# Altium schematic sheet BiSheB.SchDoc
size A4; SheetNumber: 2; SheetTotal: 2
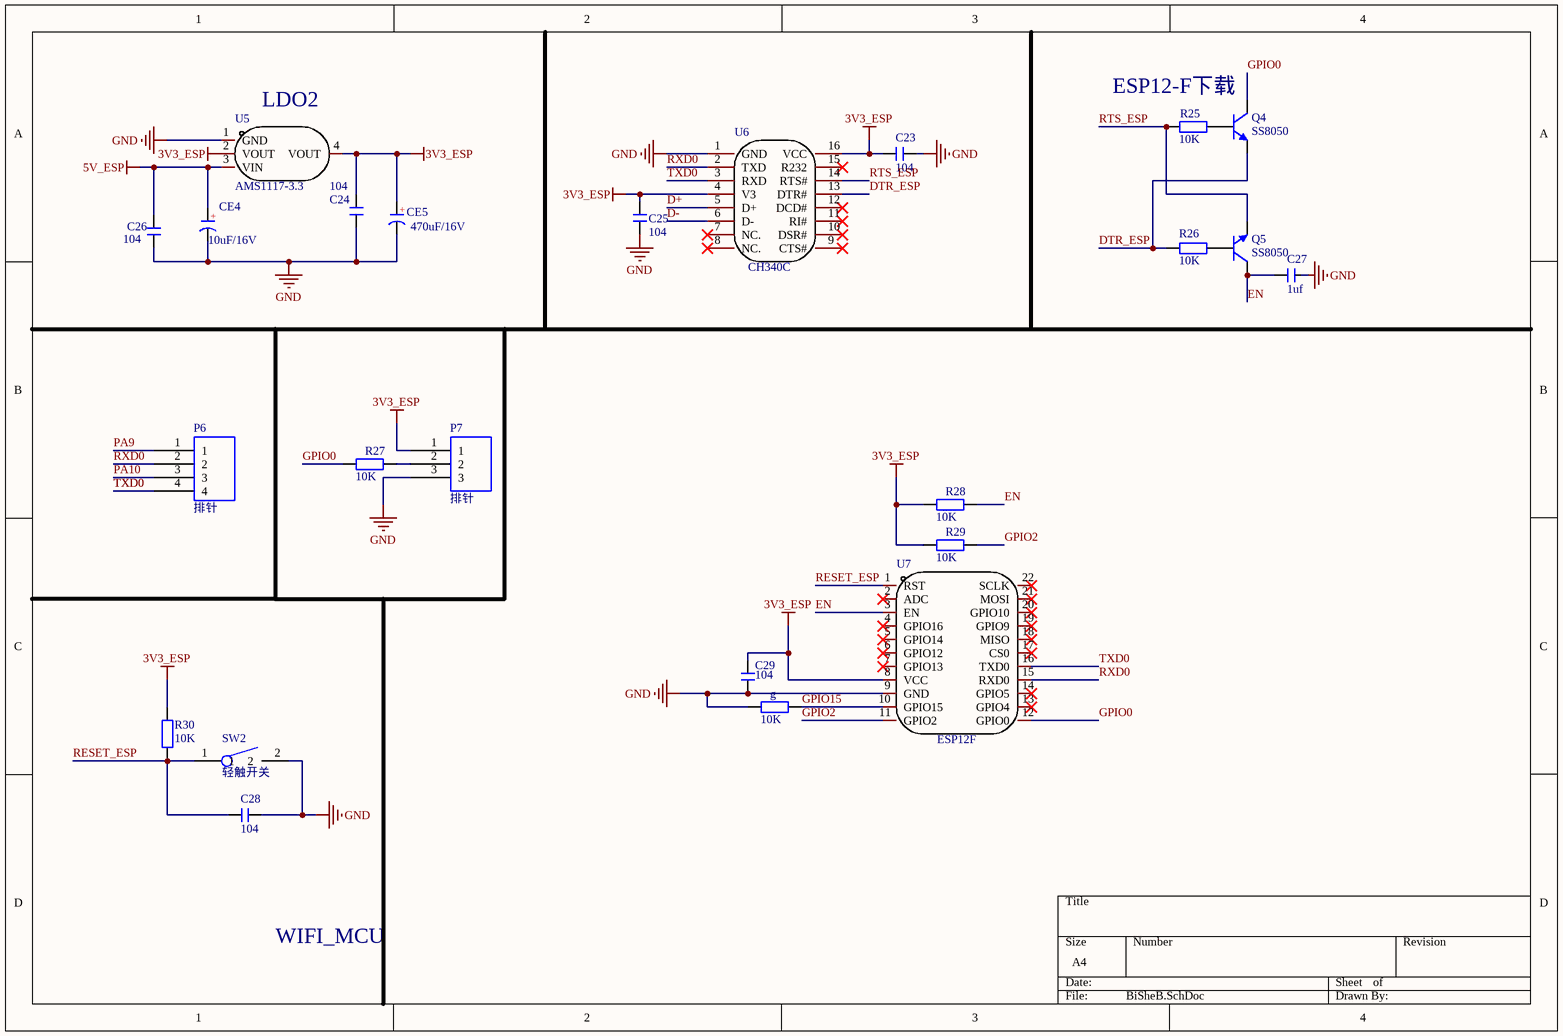
[diagram p0: BiSheB.SchDoc]

## Parts
C23  104  [C 0805_L]
C24  104  [C 0805_L]
C25  104  [C 0805_L]
C26  104  [C 0805_L]
C27  1uf  [C 0805_L]
C28  104  [C 0805_L]
C29  104  [C 0805_L]
CE4  10uF/16V  [CAP 1.5*4*8]
CE5  470uF/16V  [CAP 3.5*8*11.5]
g  10K  [R 0805_L]
P6  排针  [4PIN]
P7  排针  [3Pin]
Q4  SS8050  [SOT23-3N]
Q5  SS8050  [SOT23-3N]
R25  10K  [R 0805_L]
R26  10K  [R 0805_L]
R27  10K  [R 0805_L]
R28  10K  [R 0805_L]
R29  10K  [R 0805_L]
R30  10K  [R 0805_L]
SW2  轻触开关  [SW1P]
U5  AMS1117-3.3  [SOT-223-3_L6.5-W3.4-P2.30-LS7.0-BR]
U6  CH340C  [SOP-16_L10.0-W3.9-P1.27-LS6.0-BL]
U7  ESP12F  [WIFIM-SMD_ESP-12F-ESP8266MOD]

## Nets
3V3_ESP: C23.1 C24.2 C25.2 C29.1 CE5.1(A) P7.1 R28.1 R29.1 R30.1 U5.2(VOUT) U5.4(VOUT) U6.4(V3) U6.16(VCC) U7.8(VCC)
5V_ESP: C26.1 CE4.1(A) U5.3(VIN)
GND: C23.2 C24.1 C25.1 C26.2 C27.2 C28.2 C29.2 CE4.2(K) CE5.2(K) g.1 P7.3 SW2.2 U5.1(GND) U6.1(GND) U7.9(GND)
D+: U6.5(D+)
D-: U6.6(D-)
DTR_ESP: Q4.2(E) R26.2 U6.13(DTR#)
EN: C27.1 Q5.3(C) R28.2 U7.3(EN)
GPIO0: Q4.3(C) R27.1 U7.12(GPIO0)
GPIO2: R29.2 U7.11(GPIO2)
GPIO15: g.2 U7.10(GPIO15)
PA9: P6.1
PA10: P6.3
RESET_ESP: C28.1 R30.2 SW2.1 U7.1(RST)
RTS_ESP: Q5.2(E) R25.2 U6.14(RTS#)
RXD0: P6.2 U6.2(TXD) U7.15(RXD0)
TXD0: P6.4 U6.3(RXD) U7.16(TXD0)
NetP7_2: P7.2 R27.2
NetQ4_1: Q4.1(B) R25.1
NetQ5_1: Q5.1(B) R26.1

Not connected (* = marked no-connect by the designer): U6 7(NC.)* 8(NC.)* 9(CTS#)* 10(DSR#)* 11(RI#)* 12(DCD#)* 15(R232)*; U7 2(ADC)* 4(GPIO16)* 5(GPIO14)* 6(GPIO12)* 7(GPIO13)* 13(GPIO4)* 14(GPIO5)* 17(CS0)* 18(MISO)* 19(GPIO9)* 20(GPIO10)* 21(MOSI)* 22(SCLK)*

## Notes on the sheet
- (near U5) LDO2
- ESP12-F下载
- WIFI_MCU
- (in symbol CE) +

## Library data of the parts
C23-C29 = C: 贴片电容; BOM名称: 无极性贴片电容; 淘宝ID: 封装库来自淘宝 ID：黄晶宝石; 联系售后，技术支持: https://shop463601444.taobao.com; 唯一出售店铺网址: https://shop463601444.taobao.com
CE4 CE5 = CE: 直插电解电容; 淘宝ID: 封装库来自淘宝 ID：黄晶宝石; BOM名称: 直插电解电容; 联系售后: https://item.taobao.com/item.htm?id=566775463719
g R25-R30 = R: 贴片电阻; 版权归属: 来自淘宝 ID：黄晶宝石; 封装库来自淘宝卖家 ID：黄晶宝石: 其他店铺购入均为盗版，不享受售后技术支持服务，请立即申请退款; BOM名称: 贴片电阻; 联系售后: https://item.taobao.com/item.htm?id=566775463719
P6 = 4Pin: 4p排针
P7 = 3Pin: 3p排针
Q4 Q5 = 8050-SMD: 高频放大-NPN型; 联系售后: 最新版本发布https://item.taobao.com/item.htm?id=566775463719; 版权归属: 封装库来自淘宝 ID：黄晶宝石; 属性: 40V 1.5A 1W 100MHZ; BOM名称: 高频放大-NPN型
SW2 = SW1P: 单刀单掷清除开关
U5 = AMS1117-3.3_C6186: 输出类型:固定;输出极性:正;最大输入电压:-;输出电压:3.3V;输出电流:1A;电源纹波抑制比(PSRR):72dB@(120Hz);; Manufacturer: AMS; Add into BOM: yes; Output Type: 固定; Output Polarity: 正; Number of Outputs: 1; Output Voltage: 3.3V; Dropout Voltage: 1.3V@(800mA); Output Current: 1A; Symbol: AMS1117-3.3; Device: AMS1117-3.3_C6186; LCSC Part Name: 正 Vout=3.3V 1A 72dB@(120Hz); Supplier Part: C6186; Manufacturer Part: AMS1117-3.3; Supplier Footprint: SOT-223; JLCPCB Part Class: Basic Part; Datasheet: https://atta.szlcsc.com/upload/public/pdf/source/20180727/C6186_7A095716F0823C02F1997A905E26C086.pdf; Supplier: LCSC; Convert to PCB: yes; Maximum Input Voltage: -; Quiescent Current (Ground Current): -; Power Supply Rejection Ratio (PSRR): 72dB@(120Hz); Noise: -; Feature: -; Operating Temperature: -; AMS1117: AMS1117-3.3
U6 = CH340C: 驱动器/接收器数:-;协议类别:USB 2.0;类型:Transceiver;数据速率:2Mbps;; Manufacturer: WCH(南京沁恒); Add into BOM: yes; Protocol: USB 2.0; Supply Voltage: 3.3V, 5V; Data Rate: 2Mbps; Symbol: CH340C; Device: CH340C; LCSC Part Name: CH340C; Supplier Part: C84681; Manufacturer Part: CH340C; Supplier Footprint: SOP-16_150mil; JLCPCB Part Class: Extended Part; Datasheet: https://atta.szlcsc.com/upload/public/pdf/source/20200819/C84681_ADBED554CE321879DBD6B1D06488689C.pdf; Supplier: LCSC; Convert to PCB: yes; Number of Drivers/Receivers: -; Type: Transceiver; CH340C: CH340C
U7 = ESP-12F(ESP8266MOD): 频率:2.4GHz;发射功率:16dBm;核心处理器:ESP8266;天线形式:PCB 板载天线;接收灵敏度:-90dBm;; Manufacturer: Ai-Thinker(安信可); Add into BOM: yes; Value: 2.4GHz; Output Power: 16dBm; Support Interface: GPIO；UART；I2C；PWM；SPI；ADC; Wireless Standard: 802.11b/g/n; Operating Voltage: 3.3V; Receive  Current: 120mA; Send  Current: 170mA; Sensitivity: -90dBm; Symbol: ESP-12F(ESP8266MOD); Device: ESP-12F(ESP8266MOD); LCSC Part Name: ESP-12F(ESP8266MOD); Supplier Part: C82891; Manufacturer Part: ESP-12F(ESP8266MOD); Supplier Footprint: SMD,16x24mm; JLCPCB Part Class: Extended Part; Datasheet: https://atta.szlcsc.com/upload/public/pdf/source/20210219/C82891_ABD84A460F4F056A2757267CCCA4B508.pdf; Supplier: LCSC; Convert to PCB: yes; Core Processor: ESP8266; Antenna Type: PCB 板载天线; Operating Temperature: -40℃~+85℃; ESP: ESP12F